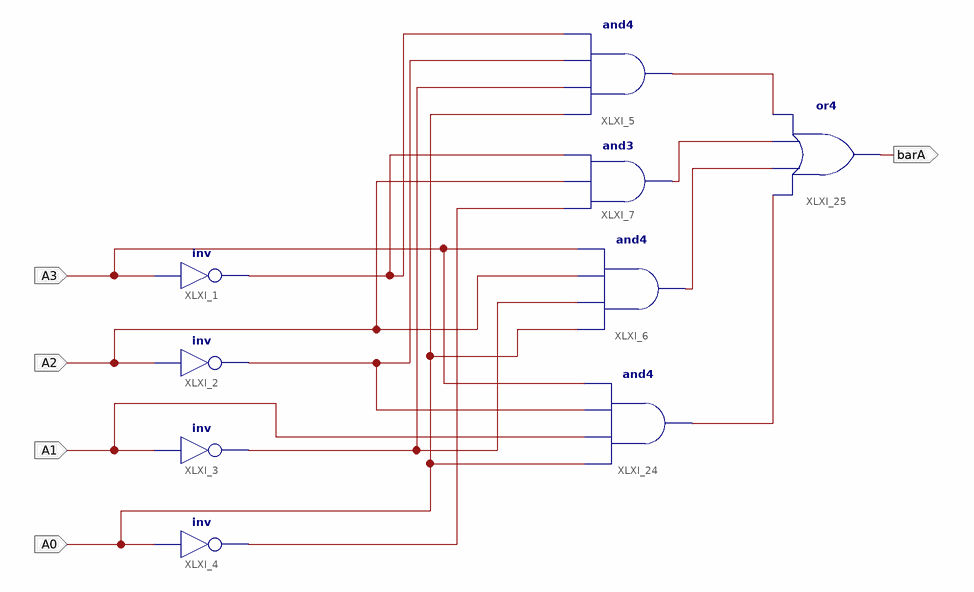
[diagram p0: schematic sheet 1]
// Xilinx ISE schematic fnd1.sch (spartan6) as structural Verilog: 9 symbols, 5 ports
module fnd1 (
  input  A3,
  input  A2,
  input  A1,
  input  A0,
  output barA
);

  wire XLXN_10, XLXN_11, XLXN_15, XLXN_26, XLXN_37, XLXN_38, XLXN_39, XLXN_40;

  not XLXI_1 (XLXN_15, A3);
  not XLXI_2 (XLXN_10, A2);
  not XLXI_3 (XLXN_11, A1);
  not XLXI_4 (XLXN_26, A0);
  and XLXI_5 (XLXN_37, A0, XLXN_11, XLXN_10, XLXN_15);
  and XLXI_6 (XLXN_39, A0, XLXN_11, A2, A3);
  and XLXI_7 (XLXN_38, XLXN_26, A2, XLXN_15);
  and XLXI_24 (XLXN_40, A0, A1, XLXN_10, A3);
  or XLXI_25 (barA, XLXN_40, XLXN_39, XLXN_38, XLXN_37);
endmodule
